# EAGLE schematic tr2_redraw (EAGLE 8.5.1)
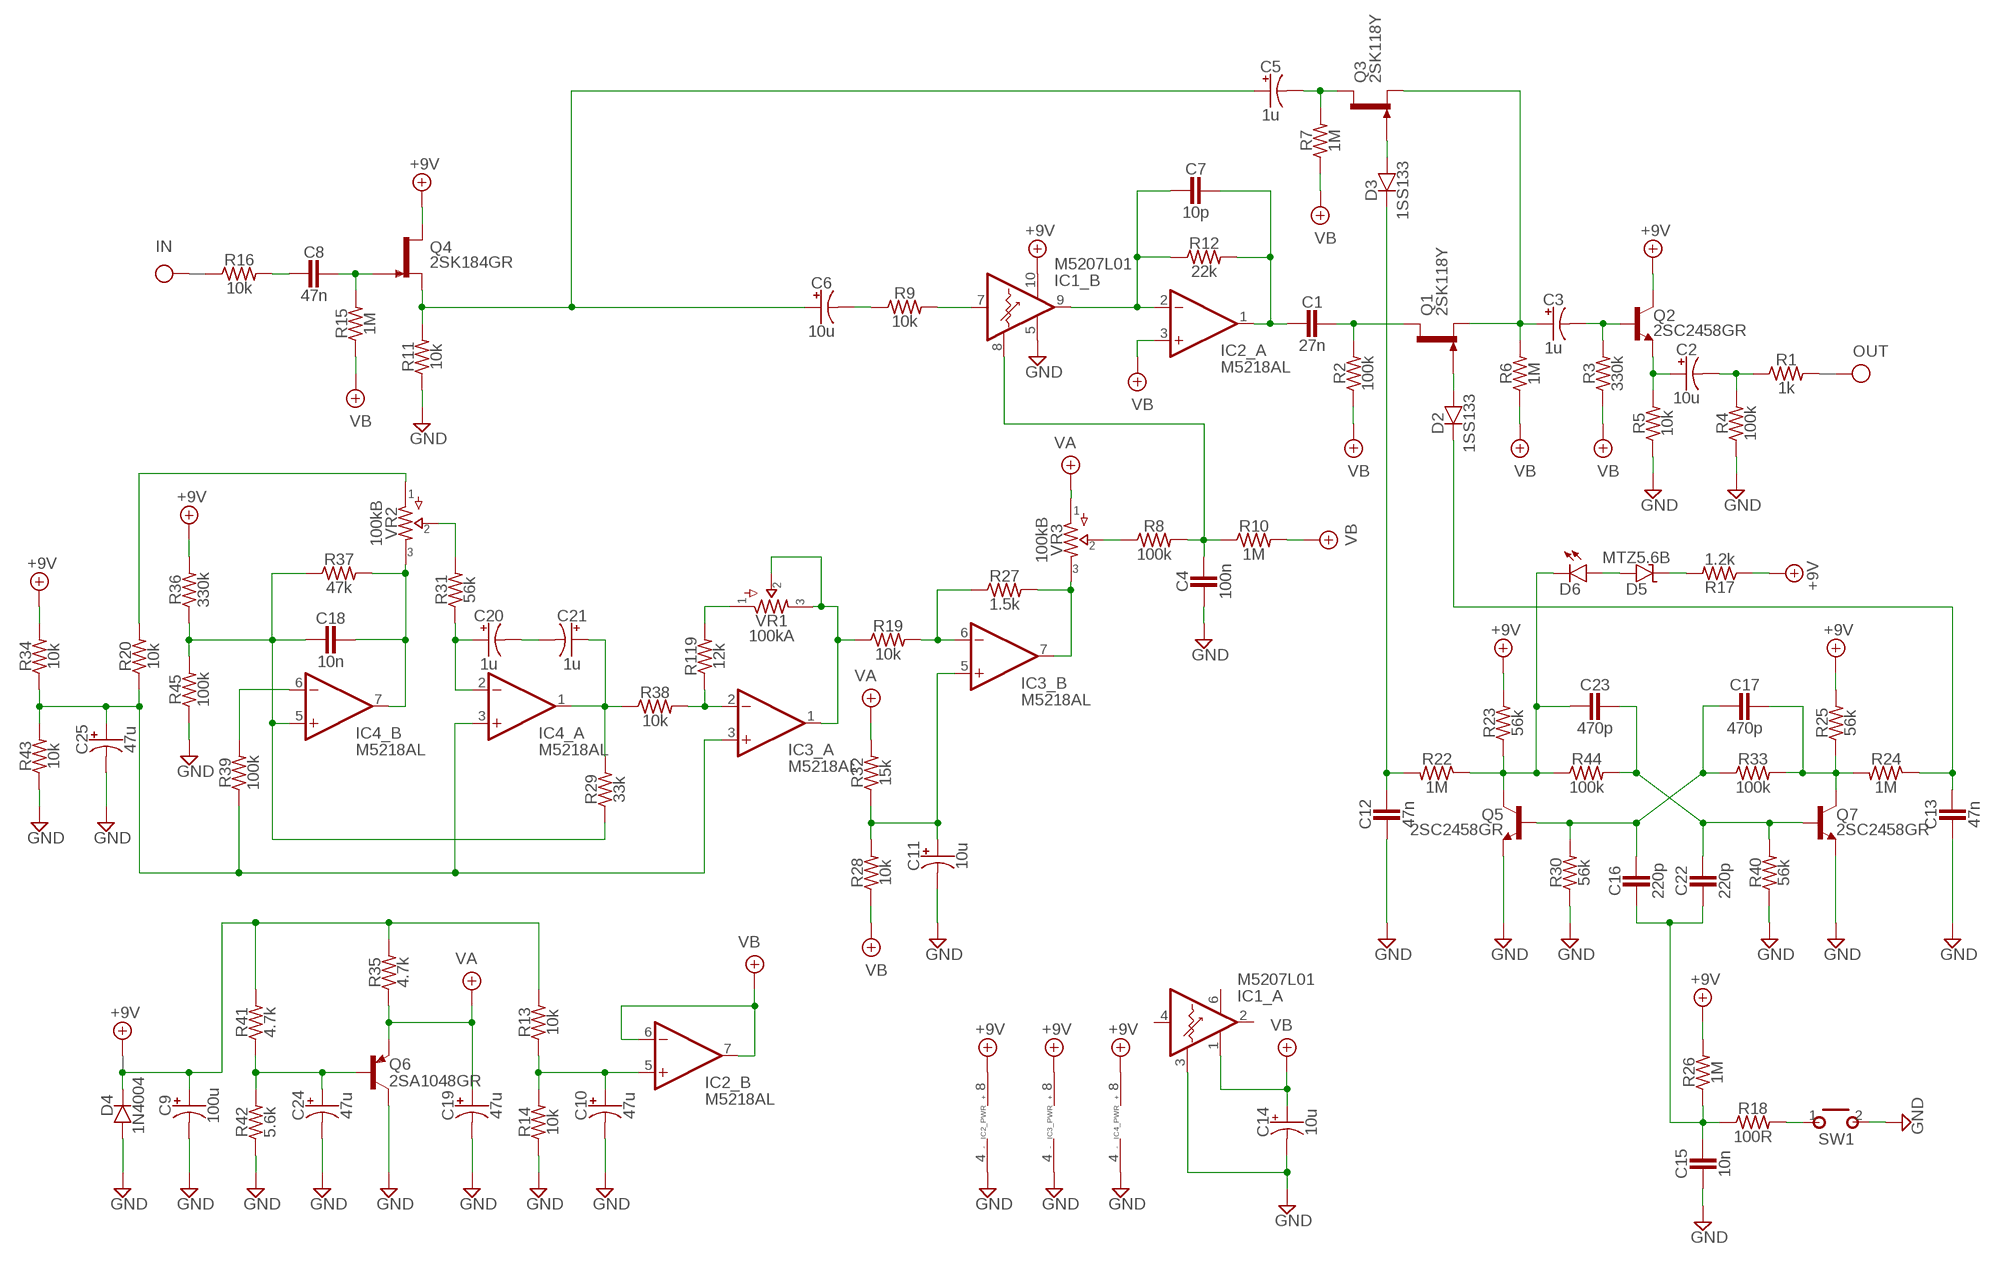
[diagram p0: schematic, sheet 1]

## Parts
C1  27n  CER/FILMBOX.1  [BOX_SMALL]
C2  10u  0400  [040_020]
C3  1u  0400  [040_020]
C4  100n  CER/FILMBOX.1  [BOX_SMALL]
C5  1u  0400  [040_020]
C6  10u  0400  [040_020]
C7  10p  CER/FILMBOX.1  [BOX_SMALL]
C8  47n  CER/FILMBOX.1  [BOX_SMALL]
C9  100u  0400  [040_020]
C10  47u  0400  [040_020]
C11  10u  0400  [040_020]
C12  47n  CER/FILMBOX.1  [BOX_SMALL]
C13  47n  CER/FILMBOX.1  [BOX_SMALL]
C14  10u  0400  [040_020]
C15  10n  CER/FILMBOX.1  [BOX_SMALL]
C16  220p  CER/FILMBOX.1  [BOX_SMALL]
C17  470p  CER/FILMBOX.1  [BOX_SMALL]
C18  10n  CER/FILMBOX.1  [BOX_SMALL]
C19  47u  0400  [040_020]
C20  1u  0400  [040_020]
C21  1u  0400  [040_020]
C22  220p  CER/FILMBOX.1  [BOX_SMALL]
C23  470p  CER/FILMBOX.1  [BOX_SMALL]
C24  47u  0400  [040_020]
C25  47u  0400  [040_020]
D2  1SS133  DO35.2  [DO35-2]
D3  1SS133  DO35.2  [DO35-2]
D4  1N4004  DO35.2  [DO35-2]
D5  MTZ5.6B  ZENER.2  [DO41-2]
D6  LN-28RP  LED  [3MM_D]
IC1  M5207L01  [SIL10]
IC2  M5218AL  DUALTH  [DIL0]
IC3  M5218AL  DUALTH  [DIL0]
IC4  M5218AL  DUALTH  [DIL0]
Q1  2SK118Y  2N3819TO-92S  [TO92-]
Q2  2SC2458GR  2SC828A  [TO92-]
Q3  2SK118Y  2N3819TO-92S  [TO92-]
Q4  2SK184GR  2N3819TO-92S  [TO92-]
Q5  2SC2458GR  2SC828A  [TO92-]
Q6  2SA1048GR  2N3906-  [TO92-]
Q7  2SC2458GR  2SC828A  [TO92-]
R1  1k  R_.3B  [R0207/3]
R2  100k  R_.3B  [R0207/3]
R3  330k  R_.3B  [R0207/3]
R4  100k  R_.3B  [R0207/3]
R5  10k  R_.3B  [R0207/3]
R6  1M  R_.3B  [R0207/3]
R7  1M  R_.3B  [R0207/3]
R8  100k  R_.3B  [R0207/3]
R9  10k  R_.3B  [R0207/3]
R10  1M  R_.3B  [R0207/3]
R11  10k  R_.3B  [R0207/3]
R12  22k  R_.3B  [R0207/3]
R13  10k  R_.3B  [R0207/3]
R14  10k  R_.3B  [R0207/3]
R15  1M  R_.3B  [R0207/3]
R16  10k  R_.3B  [R0207/3]
R17  1.2k  R_.3B  [R0207/3]
R18  100R  R_.3B  [R0207/3]
R19  10k  R_.3B  [R0207/3]
R20  10k  R_.3B  [R0207/3]
R22  1M  R_.3B  [R0207/3]
R23  56k  R_.3B  [R0207/3]
R24  1M  R_.3B  [R0207/3]
R25  56k  R_.3B  [R0207/3]
R26  1M  R_.3B  [R0207/3]
R27  1.5k  R_.3B  [R0207/3]
R28  10k  R_.3B  [R0207/3]
R29  33k  R_.3B  [R0207/3]
R30  56k  R_.3B  [R0207/3]
R31  56k  R_.3B  [R0207/3]
R32  15k  R_.3B  [R0207/3]
R33  100k  R_.3B  [R0207/3]
R34  10k  R_.3B  [R0207/3]
R35  4.7k  R_.3B  [R0207/3]
R36  330k  R_.3B  [R0207/3]
R37  47k  R_.3B  [R0207/3]
R38  10k  R_.3B  [R0207/3]
R39  100k  R_.3B  [R0207/3]
R40  56k  R_.3B  [R0207/3]
R41  4.7k  R_.3B  [R0207/3]
R42  5.6k  R_.3B  [R0207/3]
R43  10k  R_.3B  [R0207/3]
R44  100k  R_.3B  [R0207/3]
R45  100k  R_.3B  [R0207/3]
R119  12k  R_.3B  [R0207/3]
SW1  MOMENTARY  [SPST]
VR1  100kA  POTS16MM  [16MM]
VR2  100kB  POTS16MM  [16MM]
VR3  100kB  POTS16MM  [16MM]

## Nets
+9V: IC1.10(_B:+PWR) IC2.8(_PWR:V+) IC3.8(_PWR:V+) IC4.8(_PWR:V+) Q2.2(C) Q4.3(D) R17.1 R23.2 R25.2 R26.2 R34.2 R36.2
GND: C4.2 C9.- C10.- C11.- C12.2 C13.2 C14.- C15.2 C19.- C24.- C25.- D4.A IC1.3(_A:VC) IC1.5(_B:-PWR) IC2.4(_PWR:V-) IC3.4(_PWR:V-) IC4.4(_PWR:V-) Q5.3(E) Q6.1(C) Q7.3(E) R4.1 R5.1 R11.1 R14.1 R30.1 R40.1 R42.1 R43.1 R45.1 SW1.2(S)
N$1: R20.2 VR2.1
N$2: C10.+ IC2.5(_B:+IN) R13.1 R14.2
N$3: C8.1 Q4.2(G) R15.2
N$4: C24.+ Q6.2(B) R41.1 R42.2
N$5: C7.2 IC1.9(_B:OUT) IC2.2(_A:-IN) R12.1
N$6: C1.2 C7.1 IC2.1(_A:OUT) R12.2
N$7: C5.+ C6.+ Q4.1(S) R11.2
N$8: C5.- Q3.3(D) R7.2
N$9: C3.+ Q1.1(S) Q3.1(S) R6.2
N$10: D2.A Q1.2(G)
N$11: C1.1 Q1.3(D) R2.2
N$12: C3.- Q2.1(B) R3.2
N$13: C2.+ Q2.3(E) R5.2
N$14: C2.- R1.1 R4.2
N$15: C8.2 R16.2
N$16: C25.+ IC3.3(_A:+IN) IC4.3(_A:+IN) R20.1 R34.1 R39.1 R43.2
N$17: R31.2 VR2.2
N$18: D3.A Q3.2(G)
N$19: C18.2 IC4.5(_B:+IN) R29.1 R36.1 R37.1 R45.2
N$20: IC4.6(_B:-IN) R39.2
N$21: C18.1 IC4.7(_B:OUT) R37.2 VR2.3
N$22: R8.1 VR3.2
N$23: C20.+ IC4.2(_A:-IN) R31.1
N$24: C21.+ IC4.1(_A:OUT) R29.2 R38.1
N$25: C20.- C21.-
N$26: IC3.2(_A:-IN) R38.2 R119.1
N$27: C9.+ D4.C R13.2 R35.2 R41.2
N$29: C23.2 D6.P$1(C) Q5.2(C) R22.1 R23.1 R44.1
N$30: R119.2 VR1.1
N$31: C17.1 Q7.2(C) R24.2 R25.1 R33.2
N$32: C16.1 C17.2 Q5.1(B) R30.2 R33.1
N$33: IC3.1(_A:OUT) R19.1 VR1.2 VR1.3
N$34: C22.1 C23.1 Q7.1(B) R40.2 R44.2
N$35: C12.1 D3.C R22.2
N$36: C13.1 D2.C R24.1
N$38: C11.+ IC3.5(_B:+IN) R28.2 R32.1
N$39: IC3.6(_B:-IN) R19.2 R27.1
N$40: IC3.7(_B:OUT) R27.2 VR3.3
N$41: R18.2 SW1.1(P)
N$42: D5.C R17.2
N$43: D5.A D6.ANODE(A)
N$45: C4.1 IC1.8(_B:VC) R8.2 R10.1
N$46: C15.1 C16.2 C22.2 R18.1 R26.1
N$47: IC1.7(_B:IN) R9.2
N$49: C6.- R9.1
VA: C19.+ Q6.3(E) R32.2 R35.1 VR3.1
VB: C14.+ IC1.1(_A:-PWR) IC2.3(_A:+IN) IC2.6(_B:-IN) IC2.7(_B:OUT) R2.1 R3.1 R6.1 R7.1 R10.2 R15.1 R28.1
Unconnected: IC1.2(_A:OUT) IC1.4(_A:IN) R1.2 R16.1

## Power pins joined to a net without a drawn wire
+PWR: IC1.6(_A:+PWR)

## Library data of the parts
C1 C4 C7 C8 C12 C13 C15-C18 C22 C23 = pedals-capacitors-film:CER/FILM: 47 - 120pF Xicon Ceramic Disc 2.5mm lead spacing
C2 C3 C5 C6 C9-C11 C14 C19-C21 C24 C25 = pedals-capacitors-elec:040
D2-D4 = pedals-diodes:DO35: DO-35 Package Diodes: 1N914
D5 = pedals-diodes:ZENER
D6 = pedals-diodes:LED
IC1 = pedals-integrated circuits:M5207L01
IC2-IC4 = pedals-integrated circuits:DUAL: OP AMP
Q1 Q3 Q4 = pedals-transistors:2N3819: N-CHANNEL FET
Q2 Q5 Q7 = pedals-transistors:2SC828A
Q6 = pedals-transistors:2N3906: PNP Transistor
R1-R20 R22-R45 R119 = pedals-resistors:R_
SW1 = pedals-switches:MOMENTARY
VR1-VR3 = pedals-potentiometers:POTS